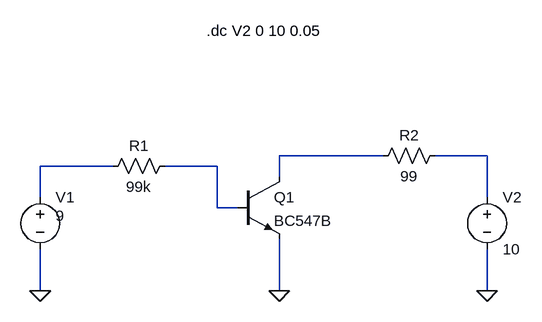
[diagram p0: schematic Draft1.asc]
Draft1.asc, the LTspice schematic file:
Version 4
SHEET 1 880 680
WIRE 384 80 224 80
WIRE 544 80 464 80
WIRE -32 96 -144 96
WIRE 128 96 48 96
WIRE 224 112 224 80
WIRE -144 144 -144 96
WIRE 544 144 544 80
WIRE 128 160 128 96
WIRE 160 160 128 160
WIRE -144 288 -144 224
WIRE 224 288 224 208
WIRE 544 288 544 224
FLAG 224 288 0
FLAG 544 288 0
FLAG -144 288 0
SYMBOL npn 160 112 R0
SYMATTR InstName Q1
SYMATTR Value BC547B
SYMBOL res 64 80 R90
WINDOW 0 0 56 VBottom 2
WINDOW 3 32 56 VTop 2
SYMATTR InstName R1
SYMATTR Value 99k
SYMBOL res 480 64 R90
WINDOW 0 0 56 VBottom 2
WINDOW 3 32 56 VTop 2
SYMATTR InstName R2
SYMATTR Value 99
SYMBOL voltage -144 128 R0
WINDOW 3 24 44 Left 2
WINDOW 123 0 0 Left 2
WINDOW 39 0 0 Left 2
SYMATTR InstName V1
SYMATTR Value 9
SYMBOL voltage 544 128 R0
WINDOW 123 0 0 Left 2
WINDOW 39 0 0 Left 2
SYMATTR InstName V2
SYMATTR Value 10
TEXT 112 -112 Left 2 !.dc V2 0 10 0.05

The netlist it stands for:
* Draft1.asc
Q1 N001 N004 0 0 BC547B
R1 N004 N003 99k
R2 N002 N001 99
V1 N003 0 9
V2 N002 0 10
.model NPN NPN
.model PNP PNP
.lib standard.bjt
.dc V2 0 10 0.05
.backanno
.end

* Results of the author's LTspice run, read from the files saved beside the schematic
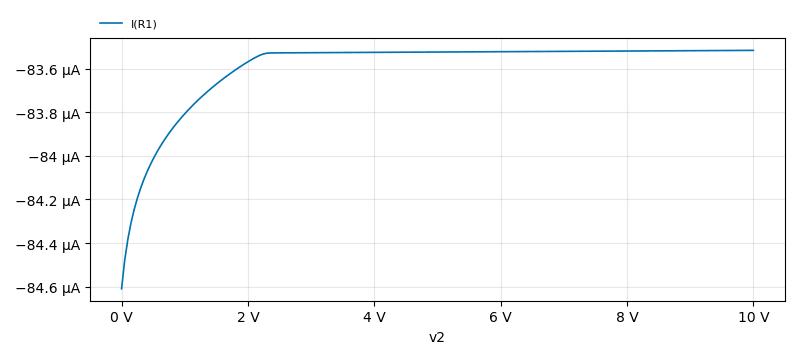
[diagram p1: DC transfer characteristic of Draft1.asc, plotted from the saved traces]
* DC transfer characteristic, 1 run:
*   I(R1): -84.61 µA at v2=0 V, -83.52 µA at v2=10 V, min -84.61 µA, max -83.52 µA